# Altium schematic sheet Display_LED.SchDoc: Red LED
size 43 x 20 mm
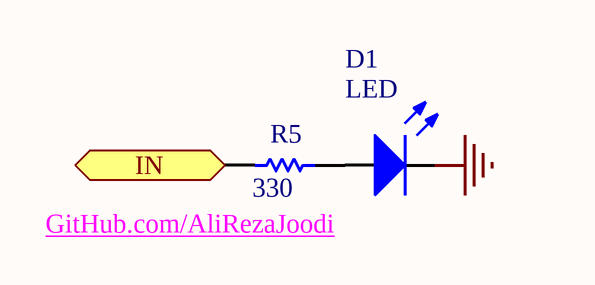
[diagram p0: Display_LED.SchDoc]

## Parts
D1  D1  [LED-5mm_Red]
R5  R5  value 330  [AXIAL-0.4]

## Ports
IN (in)

## Nets
GND: D1.2(K)
IN: R5.2 ; port IN
NetD1_1: D1.1(A) R5.1

## Notes on the sheet
- GitHub.com/AliRezaJoodi
- Sheet Title
- Project Title
- Size:
- Date:
- A4
- Item:
- Time:
- Revision:
- Sheet
- of
- File:

## Library data of the parts
D1 = LED: Typical INFRARED GaAs LED; Manufacturer: Generic Components; Class I: Optoelectronic; Published: 8-Jun-2000; Revision: July-2002: Re-released for DXP Platform.; Publisher: Altium Limited; Class II: LED
R5 = Res1: Resistor; Manufacturer: Generic Components; Class I: Passive; Published: 8-Jun-2000; Revision: July-2002: Re-released for DXP Platform.; Publisher: Altium Limited; Class II: Resistor